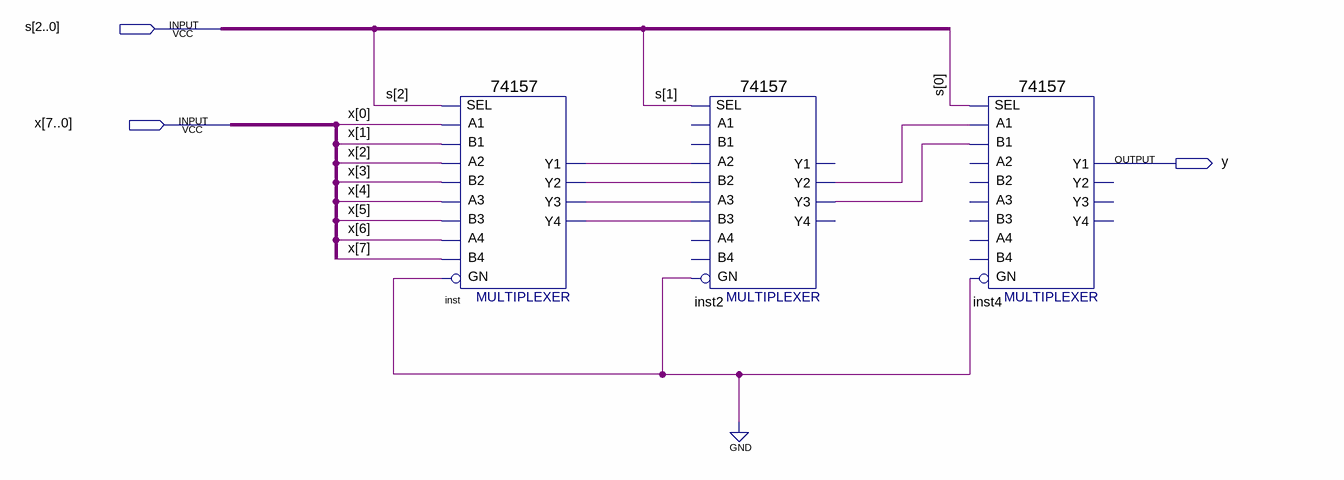
[diagram p0: schematic sheet]
// Quartus schematic testeex1.bdf as structural Verilog: 3 symbols, 3 pins
module testeex1 (
  input  [2:0] s,
  input  [7:0] x,
  output y
);

  wire inst2_y2, inst2_y3, inst_y1, inst_y2, inst_y3, inst_y4;

  \74157  inst (
    .A1(x[0]), .B1(x[1]), .SEL(s[2]), .B2(x[3]), .A3(x[4]), .B3(x[5]), .A2(x[2]), .B4(x[7]), .GN(1'b0),
    .A4(x[6]), .Y2(inst_y2), .Y1(inst_y1), .Y4(inst_y4), .Y3(inst_y3));
  \74157  inst2 (
    .SEL(s[1]), .B2(inst_y2), .A3(inst_y3), .B3(inst_y4), .A2(inst_y1), .GN(1'b0), .Y2(inst2_y2),
    .Y3(inst2_y3));  // open: A1, B1, B4, A4, Y1, Y4
  \74157  inst4 (
    .A1(inst2_y2), .B1(inst2_y3), .SEL(s[0]), .GN(1'b0), .Y1(y));  // open: B2, A3, B3, A2, B4, A4, Y2, Y4, Y3
endmodule
